# EAGLE schematic TinyDuino-noboard (EAGLE 7.1.0)
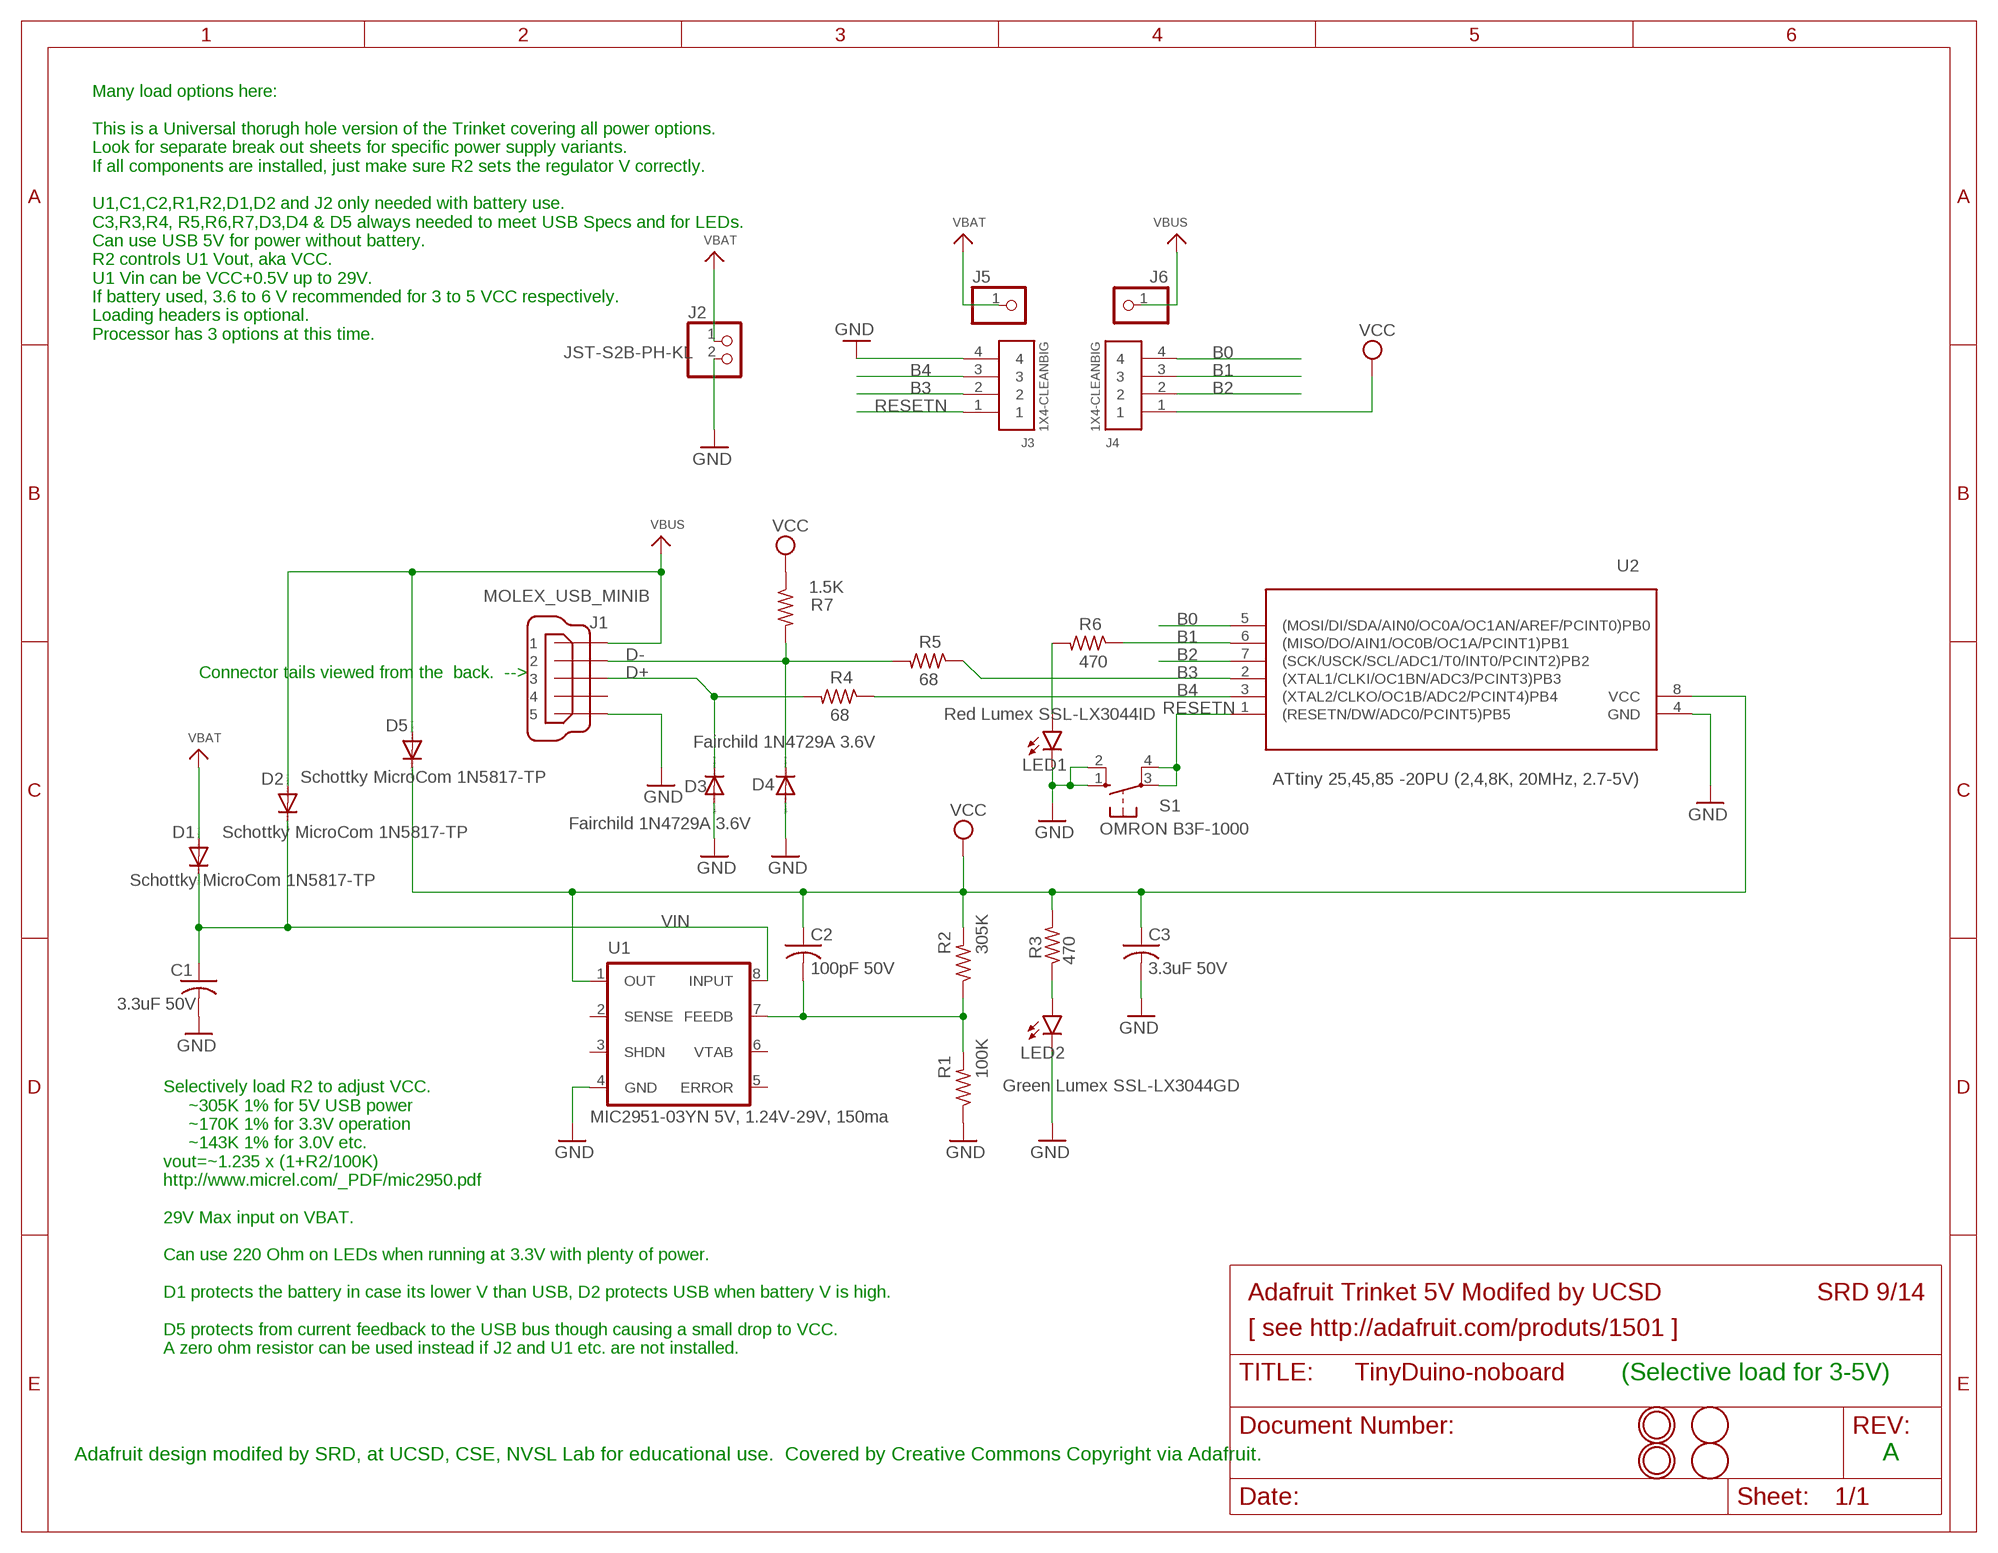
[diagram p0: schematic, sheet 1]

## Parts
C1  3.3uF 50V  C-US050-025X075  [C050-025X075]
C2  100pF 50V  C-US050-025X075  [C050-025X075]
C3  3.3uF 50V  C-US050-025X075  [C050-025X075]
D1  Schottky MicroCom 1N5817-TP  DIODE-DO41-7.6  [DO41-7.6]
D2  Schottky MicroCom 1N5817-TP  DIODE-DO41-7.6  [DO41-7.6]
D3  Fairchild 1N4729A 3.6V  DIODE-DO41-7.6  [DO41-7.6]
D4  Fairchild 1N4729A 3.6V  DIODE-DO41-7.6  [DO41-7.6]
D5  Schottky MicroCom 1N5817-TP  DIODE-DO41-7.6  [DO41-7.6]
J1  MOLEX_USB_MINIB  [32005-601-ROUND]
J2  JST-S2B-PH-KL  CON_JST_PH_2PINJST_S2B_PH_KL  [JST_S2B_PH_KL]
J3  1X4-CLEANBIG  [1X04-CLEANBIG]
J4  1X4-CLEANBIG  [1X04-CLEANBIG]
J5  PINHD-1X1CB  [1X01-CLEANBIG]
J6  PINHD-1X1CB  [1X01-CLEANBIG]
LED1  Red Lumex SSL-LX3044ID  LED3MM  [LED3MM]
LED2  Green Lumex SSL-LX3044GD  LED3MM  [LED3MM]
R1  100K  R-US_0204/7  [0204/7]
R2  305K  R-US_0204/7  [0204/7]
R3  470  R-US_0204/7  [0204/7]
R4  68  R-US_0204/7  [0204/7]
R5  68  R-US_0204/7  [0204/7]
R6  470  R-US_0204/7  [0204/7]
R7  1.5K  R-US_0204/7  [0204/7]
S1  OMRON B3F-1000  10-XX  [B3F-10XX]
U1  MIC2951-03YN 5V, 1.24V-29V, 150ma  MIC2951-03YNCN  [DIL08]
U2  ATtiny 25,45,85 -20PU (2,4,8K, 20MHz, 2.7-5V)  ATTINY85-20P  [DIL08]
Z1  MOUNTINGHOLE2.0  [MOUNTINGHOLE_2.0_PLATED]
Z2  MOUNTINGHOLE2.0  [MOUNTINGHOLE_2.0_PLATED]
Z3  FIDUCIAL  [FIDUCIAL_1MM]
Z4  FIDUCIAL  [FIDUCIAL_1MM]

## Nets
B0: J4.4 U2.5((MOSI/DI/SDA/AIN0/OC0A/OC1AN/AREF/PCINT0)PB0)
B1: J4.3 R6.1 U2.6((MISO/DO/AIN1/OC0B/OC1A/PCINT1)PB1)
B2: J4.2 U2.7((SCK/USCK/SCL/ADC1/T0/INT0/PCINT2)PB2)
B3: J3.2 R5.1 U2.2((XTAL1/CLKI/OC1BN/ADC3/PCINT3)PB3)
B4: J3.3 R4.1 U2.3((XTAL2/CLKO/OC1B/ADC2/PCINT4)PB4)
D+: D3.C J1.3 R4.2
D-: D4.C J1.2 R5.2 R7.2
GND: C1.2 C3.2 D3.A D4.A J1.5 J2.2 J3.4 LED1.K(C) LED2.K(C) R1.1 S1.1(S) S1.2(S1) U1.4(GND) U2.4(GND)
N$1: LED1.A R6.2
N$3: LED2.A R3.1
N$4: C2.2 R1.2 R2.1 U1.7(FEEDB)
RESETN: J3.1 S1.3(P) S1.4(P1) U2.1((RESETN/DW/ADC0/PCINT5)PB5)
VBAT: D1.A J2.1 J5.1
VBUS: D2.A D5.A J1.1 J6.1
VCC: C2.1 C3.1 D5.C J4.1 R2.2 R3.2 R7.1 U1.1(OUT) U2.8(VCC)
VIN: C1.1 D1.C D2.C U1.8(INPUT)
Unconnected: J1.4 J1.M1(S1) J1.M2(S2) U1.2(SENSE) U1.3(SHDN) U1.5(ERROR) U1.6(VTAB)

## Notes on the sheet
- Many load options here:
  
  This is a Universal thorugh hole version of the Trinket covering all power options.
  Look for separate break out sheets for specific power supply variants.
  If all components are installed, just make sure R2 sets the regulator V correctly.
  
  U1,C1,C2,R1,R2,D1,D2 and J2 only needed with battery use.
  C3,R3,R4, R5,R6,R7,D3,D4 & D5 always needed to meet USB Specs and for LEDs.
  Can use USB 5V for power without battery.
  R2 controls U1 Vout, aka VCC.
  U1 Vin can be VCC+0.5V up to 29V.
  If battery used, 3.6 to 6 V recommended for 3 to 5 VCC respectively.
  Loading headers is optional.
  Processor has 3 options at this time.
- Connector tails viewed from the  back.  -->
- Adafruit Trinket 5V Modifed by UCSD | SRD 9/14
- [ see http://adafruit.com/produts/1501 ]
- Selectively load R2 to adjust VCC.
       ~305K 1% for 5V USB power
       ~170K 1% for 3.3V operation
       ~143K 1% for 3.0V etc.
  vout=~1.235 x (1+R2/100K)
  http://www.micrel.com/_PDF/mic2950.pdf
  
  29V Max input on VBAT.
  
  Can use 220 Ohm on LEDs when running at 3.3V with plenty of power.
  
  D1 protects the battery in case its lower V than USB, D2 protects USB when battery V is high.
  
  D5 protects from current feedback to the USB bus though causing a small drop to VCC. 
  A zero ohm resistor can be used instead if J2 and U1 etc. are not installed.
- (Selective load for 3-5V)
- Adafruit design modifed by SRD, at UCSD, CSE, NVSL Lab for educational use.  Covered by Creative Commons Copyright via Adafruit. | A

## Library data of the parts
C1 C3 = resistor:C-US: CAPACITOR, American symbol; DIST-1: DigiKey; DIST-1-PN: 445-8459-ND; MFR: TDK; PARTNO: FK20X7R1H335K; TOL: 10%; VOLT: 50V
C2 = resistor:C-US: CAPACITOR, American symbol; DIST-1: DigiKey; DIST-1-PN: 445-4726-ND; MFR: TDK; PARTNO: FK28C0G1H101J; TOL: 10%; VOLT: 50V
D1 D2 D5 = diode:DIODE-: DIODE; DIST-1: DigiKey; DIST-1-PN: 1N5817-TPCT-ND; MFR: Micro Com.; PARTNO: 1N5817-TP; TYPE: Schottky
D3 D4 = diode:DIODE-: DIODE; DIST-1: DigiKey; DIST-1-PN: 1N4729AFS-ND; MFR: Fairchild; PARTNO: 1N4729A; TYPE: Zener
J1 = Trinket TH:MOLEX_USB_MINIB: MINI USB-B R/A DIP 5pol. Molex 0548190519; DIST-1: DigiKey; DIST-1-PN: WM17115-ND; MFR: Molex; PARTNO: 0548190519
J2 = Adafruit Trinket 5V:CON_JST_PH_2PIN: JST 2-Pin Right-Angle Connector PH-Series - 4UConnector: 17311 SH-Series - 4UConnector: 07278; DIST-1: DigiKey; DIST-1-PN: 455-1719-ND; MFR: JST; PARTNO: JST_S2B_PH_KL
J3 J4 = adafruit:1X4: 4-pin connector; BOM: EXCLUDE; DNP: T
J5 J6 = adafruit:PINHD-1X1: Pin header 1x1 for 0.1" spacing With round pins; BOM: EXCLUDE; DNP: T
LED1 = SparkFun-LED:LED: LEDs Standard schematic elements and footprints for 5mm, 3mm, 1206, and 0603 sized LEDs. 5mm - Spark Fun Electronics SKU : COM-00529 (and others); COLOR: RED; DIST-1: DigiKey; DIST-1-PN: 67-1066-ND; MFR: Lumex; PARTNO: SSL-LX3044ID
LED2 = SparkFun-LED:LED: LEDs Standard schematic elements and footprints for 5mm, 3mm, 1206, and 0603 sized LEDs. 5mm - Spark Fun Electronics SKU : COM-00529 (and others); COLOR: GREEN; DIST-1: DigiKey; DIST-1-PN: 67-1060-ND; MFR: Lumex; PARTNO: SSL-LX3044GD
R1 = Adafruit Trinket 5V:R-US_: RESISTOR, American symbol; DIST-1: DigiKey; DIST-1-PN: 100KXBK-ND; MFR: Yageo; PARTNO: MFR-25FBF52-100K; RATE: 1/4W; TOL: 1%
R2 = Adafruit Trinket 5V:R-US_: RESISTOR, American symbol; DIST-1: DigiKey; DIST-1-PN: 301KXBK-ND; MFR: Yageo; PARTNO: MFR-25FBF52-301K; PLACE: for 5V only; RATE: 1/4W; TOL: 1%
R3 R6 = Adafruit Trinket 5V:R-US_: RESISTOR, American symbol; DIST-1: DigiKey; DIST-1-PN: 470EBK-ND; MFR: Yageo; PARTNO: CFR-12JB-52-470R; RATE: 1/6W; TOL: 5%
R4 R5 = Adafruit Trinket 5V:R-US_: RESISTOR, American symbol; DIST-1: DigiKey; DIST-1-PN: 68EBK-ND; MFR: Yageo; PARTNO: CFR-12JB-52-68R; RATE: 1/6W; TOL: 5%
R7 = Adafruit Trinket 5V:R-US_: RESISTOR, American symbol; DIST-1: DigiKey; DIST-1-PN: 1.5KEBK-ND; MFR: Yageo; PARTNO: CFR-12JB-52-1K5; RATE: 1/6W; TOL: 5%
S1 = switch-omron:10-XX: OMRON SWITCH; DIST-1: DigiKey; DIST-1-PN: SW400-ND; MFR: Omron; PARTNO: B3F-1000
U1 = Adafruit Trinket 5V TH:MIC2951-03YN: Adjustable Micropower Voltage Regulator Source: http://cache.national.com/ds/LP/LP2950.pdf; DIST-1: DigiKey; DIST-1-PN: 576-1150-ND; MFR: Micrel; PARTNO: MIC2951-03YN
U2 = Trinket TH:ATTINY85: MICROCONTROLLER 8 Kbytes FLASH 512 bytes EEPROM 512 bytes RAM 4-channel 10 bit ADC USI; DIST-1: DigiKey; DIST-1-PN: ATTINY85-20PU-ND; MFR: Atmel; PARTNO: ATTINY85-20PU-ND
Z1 Z2 = microbuilder:MOUNTINGHOLE: Mounting Hole For #2 screws (0.086"/2.18mm width, 0.094"/2.4mm hole) use 2.5mm; BOM: EXCLUDE; DNP: T
Z3 Z4 = adafruit:FIDUCIAL: For use by pick and place machines to calibrate the vision/machine, 1mm By microbuilder.eu; BOM: EXCLUDE; DNP: T

## Net classes
1 power: width 0.305 mm